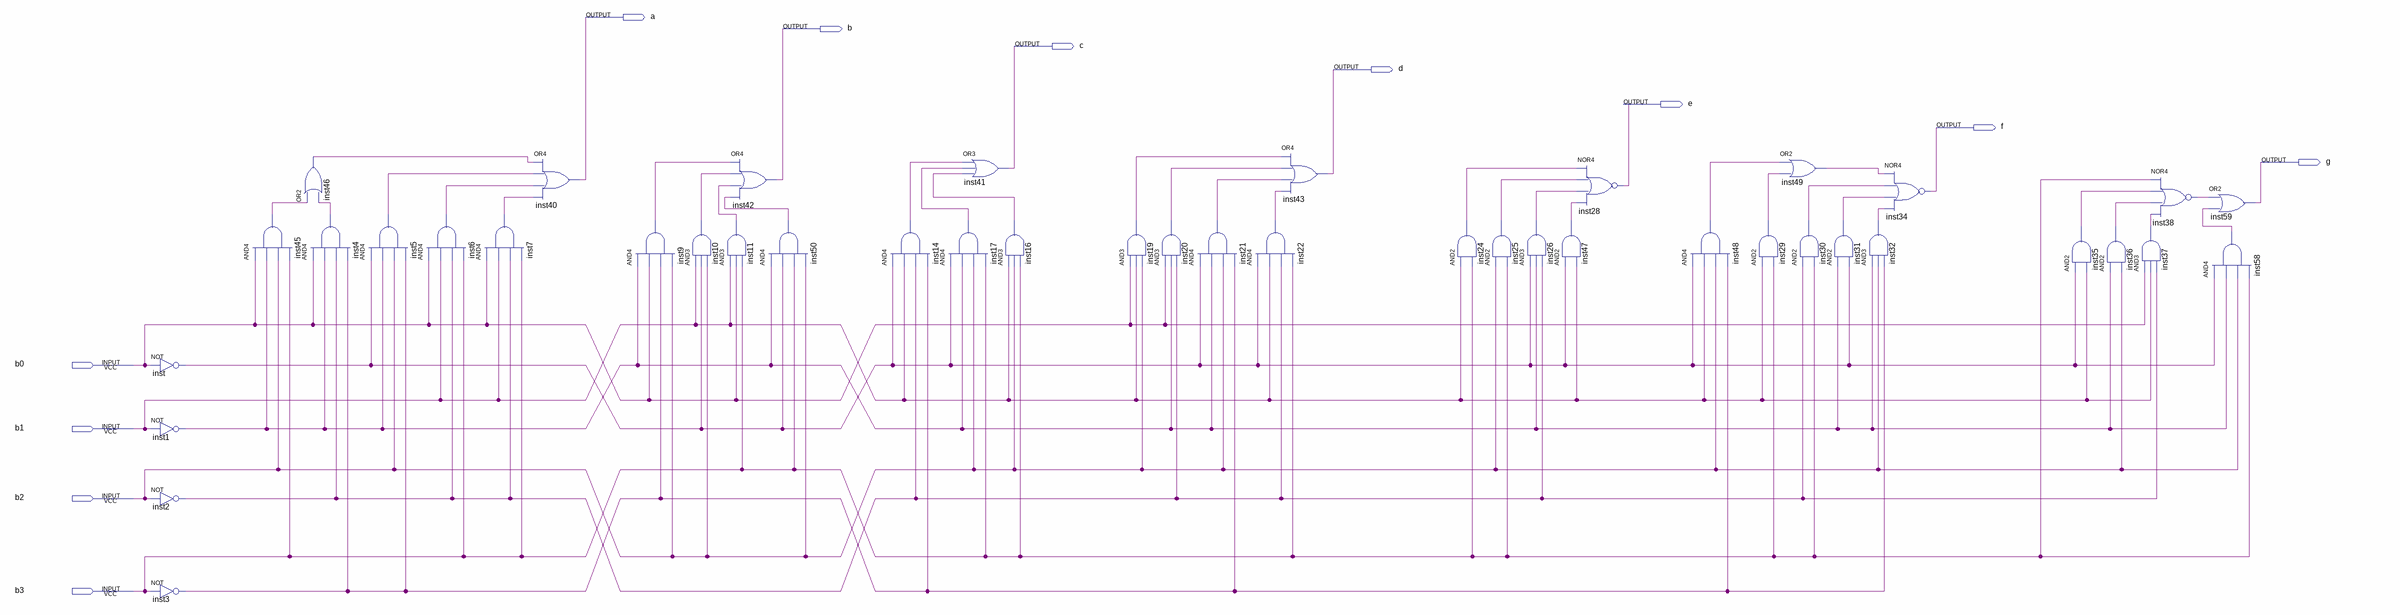
[diagram p0: schematic sheet]
// Quartus schematic Display.bdf as structural Verilog: 43 symbols, 11 pins
module Display (
  input  b0,
  input  b1,
  input  b2,
  input  b3,
  output a,
  output b,
  output c,
  output d,
  output e,
  output f,
  output g
);

  wire inst1_out, inst2_out, inst3_out, inst4_out, inst5_out, inst6_out, inst7_out, inst9_out, inst10_out,
       inst11_out, inst14_out, inst16_out, inst17_out, inst19_out, inst20_out, inst21_out, inst22_out,
       inst24_out, inst25_out, inst26_out, inst29_out, inst30_out, inst31_out, inst32_out, inst35_out,
       inst36_out, inst37_out, inst38_out, inst45_out, inst46_out, inst47_out, inst48_out, inst49_out,
       inst50_out, inst58_out, inst_out;

  not inst (inst_out, b0);
  not inst1 (inst1_out, b1);
  not inst2 (inst2_out, b2);
  not inst3 (inst3_out, b3);
  and inst45 (inst45_out, b0, inst1_out, b2, b3);
  or inst46 (inst46_out, inst45_out, inst4_out);
  and inst4 (inst4_out, b0, inst1_out, inst2_out, inst3_out);
  and inst5 (inst5_out, inst_out, inst1_out, b2, inst3_out);
  and inst6 (inst6_out, b0, b1, inst2_out, b3);
  and inst7 (inst7_out, b0, b1, inst2_out, b3);
  or inst40 (a, inst46_out, inst5_out, inst6_out, inst7_out);
  and inst9 (inst9_out, inst1_out, b0, inst3_out, b2);
  and inst10 (inst10_out, b1, inst_out, b2);
  and inst11 (inst11_out, b1, b0, b3);
  or inst42 (b, inst9_out, inst10_out, inst11_out, inst50_out);
  and inst50 (inst50_out, inst1_out, inst_out, b3, b2);
  and inst14 (inst14_out, inst_out, b1, inst2_out, inst3_out);
  and inst17 (inst17_out, inst_out, inst1_out, b2, b3);
  or inst41 (c, inst14_out, inst17_out, inst16_out);
  and inst16 (inst16_out, b1, b2, b3);
  and inst19 (inst19_out, b0, b1, b2);
  and inst20 (inst20_out, b0, inst1_out, inst2_out);
  and inst21 (inst21_out, inst_out, inst1_out, b2, inst3_out);
  and inst22 (inst22_out, inst_out, b1, inst2_out, b3);
  or inst43 (d, inst19_out, inst20_out, inst21_out, inst22_out);
  and inst24 (inst24_out, b1, b3);
  and inst25 (inst25_out, b2, b3);
  and inst26 (inst26_out, inst_out, inst1_out, inst2_out);
  and inst47 (inst47_out, inst_out, b1);
  nor inst28 (e, inst24_out, inst25_out, inst26_out, inst47_out);
  and inst48 (inst48_out, inst_out, b1, b2, inst3_out);
  or inst49 (inst49_out, inst48_out, inst29_out);
  and inst29 (inst29_out, b1, b3);
  and inst30 (inst30_out, inst2_out, b3);
  and inst31 (inst31_out, inst1_out, inst_out);
  and inst32 (inst32_out, inst1_out, b2, inst3_out);
  nor inst34 (f, inst49_out, inst30_out, inst31_out, inst32_out);
  and inst35 (inst35_out, inst_out, b1);
  and inst36 (inst36_out, inst1_out, b2);
  nor inst38 (inst38_out, b3, inst35_out, inst36_out, inst37_out);
  and inst37 (inst37_out, b0, b1, inst2_out);
  and inst58 (inst58_out, inst_out, inst1_out, b2, b3);
  or inst59 (g, inst38_out, inst58_out);
endmodule
